# Altium schematic sheet channel.SchDoc: Pulser Harness Channel
size A4; Date: 04.08.2023; DocumentNumber: 1; SheetNumber: 2; SheetTotal: 2; FileInfo: channel.SchDoc
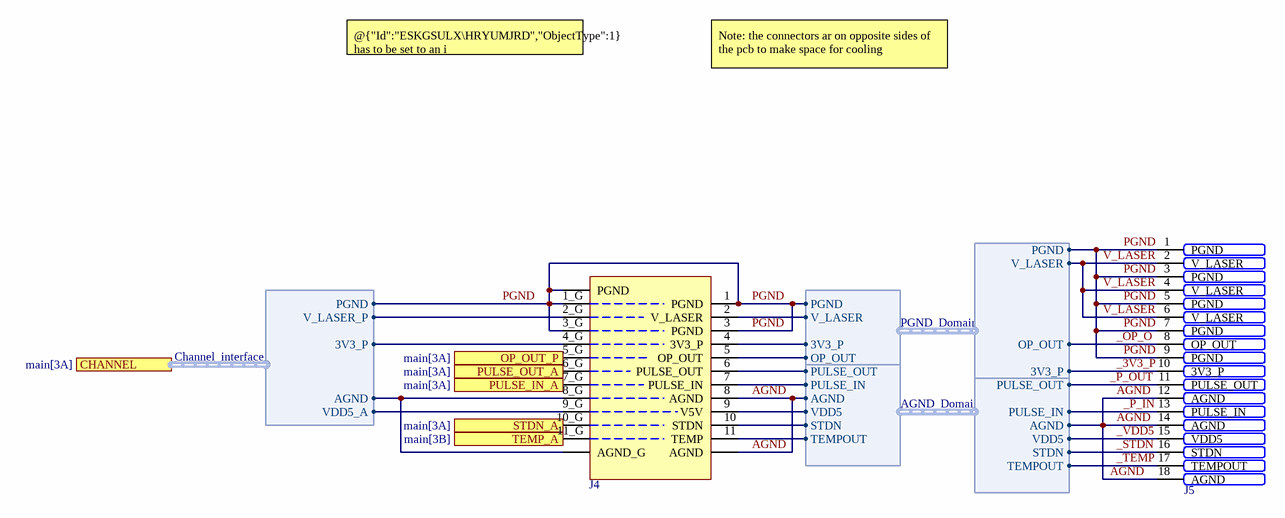
[diagram p0: channel.SchDoc]

## Parts
J4  LD_driver_footprint  [Driver_footprint]  (value not drawn)  (no BOM)
J5  FPC_conn  [FPC_connector_18_0.5]  (value not drawn)  (no BOM)

## Ports
CHANNEL (harness Channel_interface, see main[3A]), OP_OUT_P (out, see main[3A]), PULSE_IN_A (in, see main[3A]), PULSE_OUT_A (out, see main[3A]), STDN_A (in, see main[3A]), TEMP_A (out, see main[3B])

## Harnesses
PGND_Domain: V_LASER, PGND, 3V3_P, OP_OUT
AGND_Domain: VDD5, AGND, PULSE_IN, PULSE_OUT, STDN, TEMPOUT
Channel_interface: VDD5_A, AGND, V_LASER_P, PGND, 3V3_P

## Nets
_3V3_P: J4.4(3V3_P) J5.10(3V3_P) ; harness PGND_Domain.3V3_P
_OP_O: J4.5(OP_OUT) J5.8(OP_OUT) ; harness PGND_Domain.OP_OUT
_P_IN: J4.7(PULSE_IN) J5.13(PULSE_IN) ; harness AGND_Domain.PULSE_IN
_P_OUT: J4.6(PULSE_OUT) J5.11(PULSE_OUT) ; harness AGND_Domain.PULSE_OUT
_STDN: J4.10(STDN) J5.16(STDN) ; harness AGND_Domain.STDN
_TEMP: J4.11(TEMP) J5.17(TEMPOUT) ; harness AGND_Domain.TEMPOUT
_VDD5: J4.9(V5V) J5.15(VDD5) ; harness AGND_Domain.VDD5
AGND: J4.8(AGND) J4.AGND J5.12(AGND) J5.14(AGND) J5.18(AGND) ; harness AGND_Domain.AGND
OP_OUT_P: J4.5_G ; port OP_OUT_P
PGND: J4.1(PGND) J4.1_G J4.3(PGND) J4.3_G J4.PGND J5.1(PGND) J5.3(PGND) J5.5(PGND) J5.7(PGND) J5.9(PGND) ; harness PGND_Domain.PGND
PULSE_IN_A: J4.7_G ; port PULSE_IN_A
PULSE_OUT_A: J4.6_G ; port PULSE_OUT_A
STDN_A: J4.10_G ; port STDN_A
TEMP_A: J4.11_G ; port TEMP_A
V_LASER: J4.2(V_LASER) J5.2(V_LASER) J5.4(V_LASER) J5.6(V_LASER) ; harness PGND_Domain.V_LASER
NetJ4_2_G: J4.2_G ; port CHANNEL.V_LASER_P
NetJ4_4_G: J4.4_G ; port CHANNEL.3V3_P
NetJ4_8_G: J4.8_G J4.AGND_G ; port CHANNEL.AGND
NetJ4_9_G: J4.9_G ; port CHANNEL.VDD5_A

## Notes on the sheet
- @{"Id":"ESKGSULX\HRYUMJRD","ObjectType":1} has to be set to an i
- Note: the connectors ar on opposite sides of the pcb to make space for cooling
- Project:
- Laboratory:
- Date:
- File:
- Rev:
- Variation:
- Drawn By:
- Checked By:
- Sheet:
- /

## Library data of the parts
J4 = LD_Driver: footprint LD driver
J5 = FPC_connector_pulser: Connector FPC, 18 pin, 0.5mm pitch